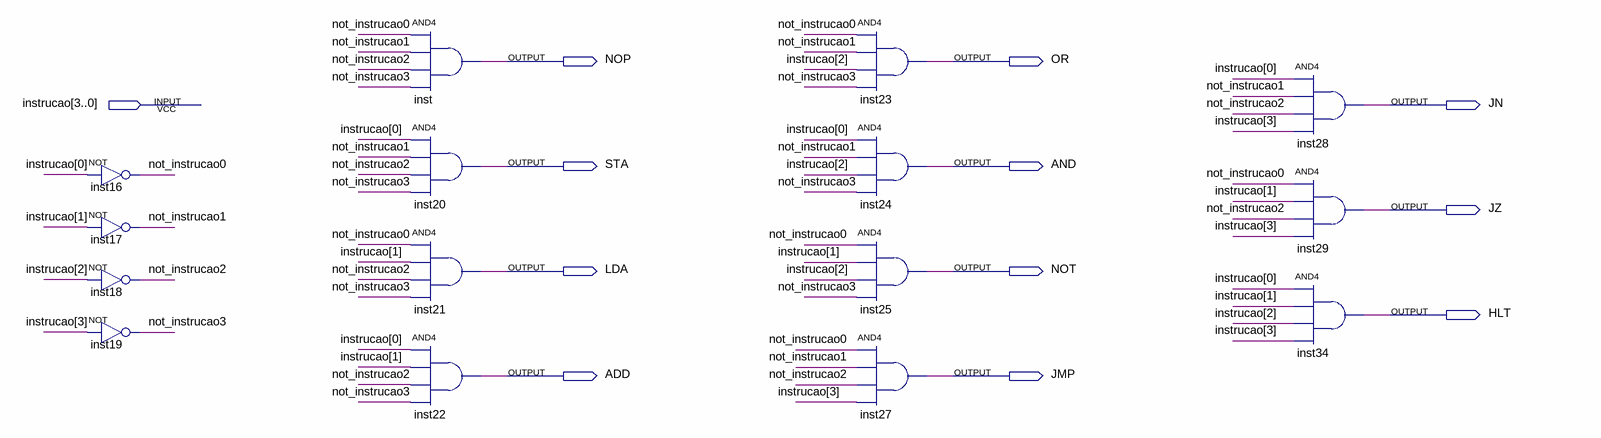
[diagram p0: schematic sheet]
// Quartus schematic DEC_INSTRUCAO.bdf as structural Verilog: 15 symbols, 12 pins
module DEC_INSTRUCAO (
  input  [3:0] instrucao,
  output NOP,
  output OR,
  output JN,
  output STA,
  output AND,
  output JZ,
  output LDA,
  output NOT,
  output HLT,
  output ADD,
  output JMP
);

  wire not_instrucao0, not_instrucao1, not_instrucao2, not_instrucao3;

  not inst16 (not_instrucao0, instrucao[0]);
  not inst17 (not_instrucao1, instrucao[1]);
  not inst18 (not_instrucao2, instrucao[2]);
  not inst19 (not_instrucao3, instrucao[3]);
  and inst (NOP, not_instrucao0, not_instrucao1, not_instrucao2, not_instrucao3);
  and inst20 (STA, instrucao[0], not_instrucao1, not_instrucao2, not_instrucao3);
  and inst21 (LDA, not_instrucao0, instrucao[1], not_instrucao2, not_instrucao3);
  and inst22 (ADD, instrucao[0], instrucao[1], not_instrucao2, not_instrucao3);
  and inst23 (OR, not_instrucao0, not_instrucao1, instrucao[2], not_instrucao3);
  and inst24 (AND, instrucao[0], not_instrucao1, instrucao[2], not_instrucao3);
  and inst25 (NOT, not_instrucao0, instrucao[1], instrucao[2], not_instrucao3);
  and inst27 (JMP, not_instrucao0, not_instrucao1, not_instrucao2, instrucao[3]);
  and inst28 (JN, instrucao[0], not_instrucao1, not_instrucao2, instrucao[3]);
  and inst29 (JZ, not_instrucao0, instrucao[1], not_instrucao2, instrucao[3]);
  and inst34 (HLT, instrucao[0], instrucao[1], instrucao[2], instrucao[3]);
endmodule
